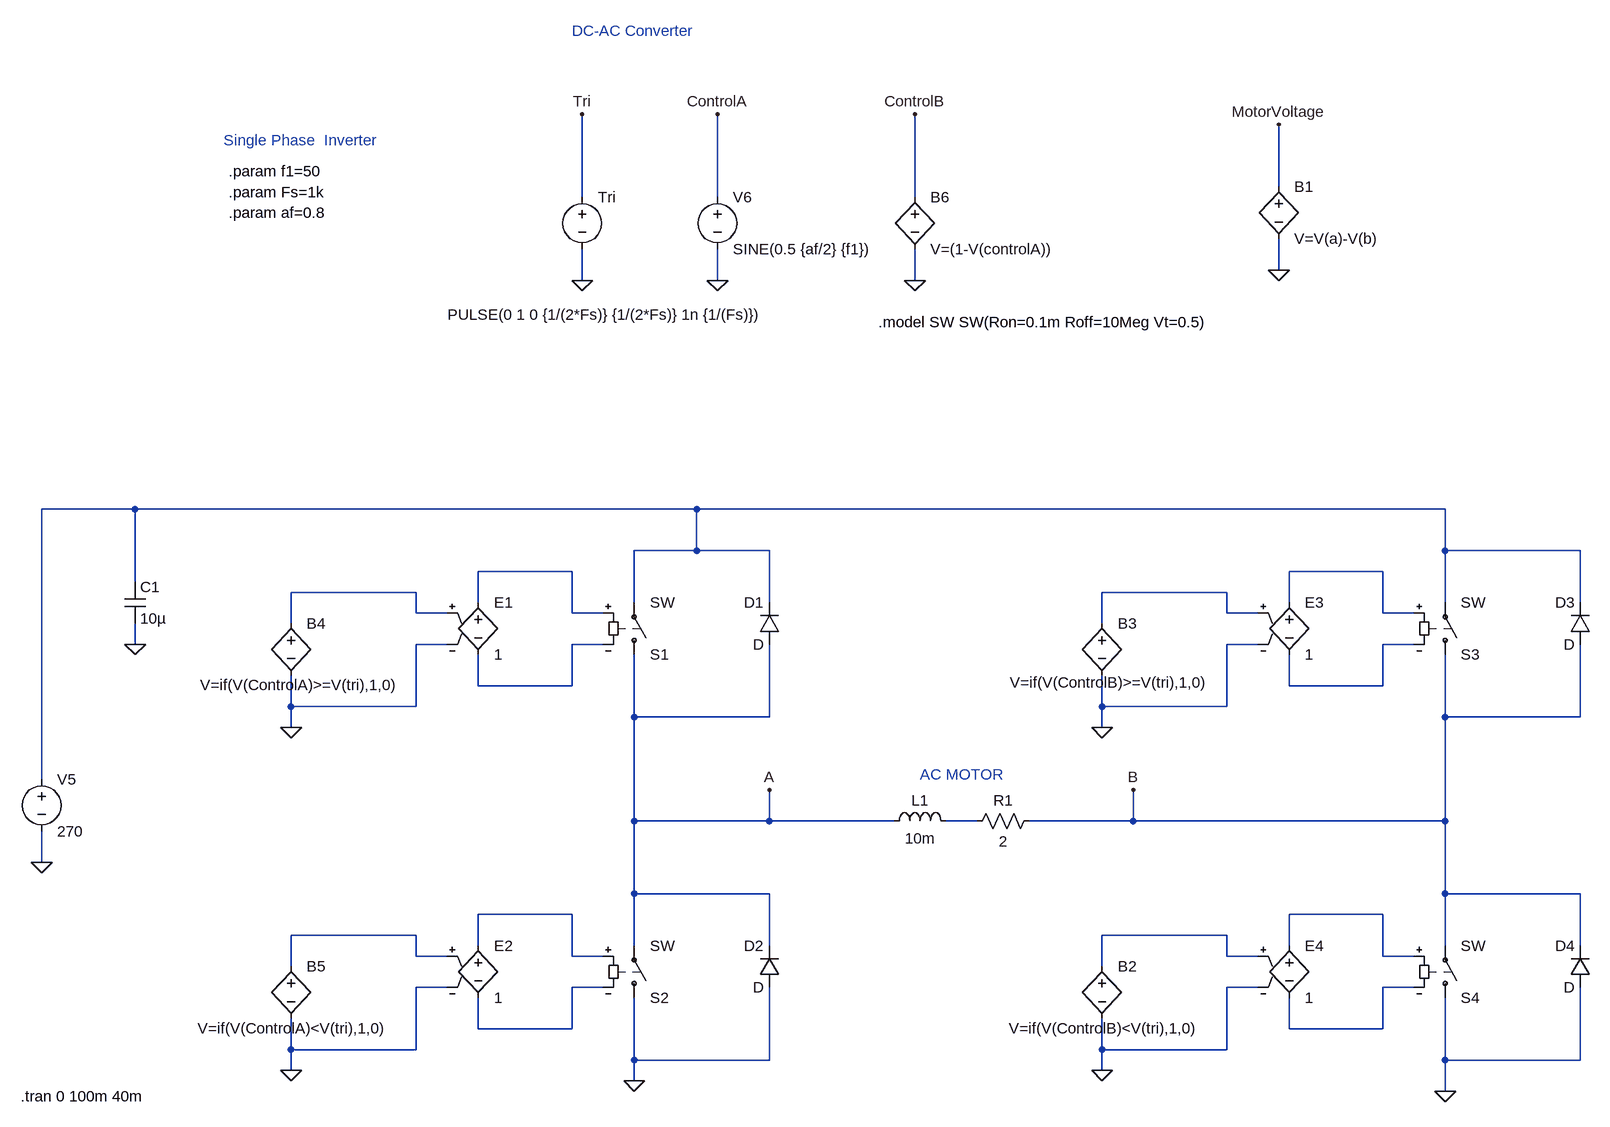
[diagram p0: schematic schematic.asc]
schematic.asc, the LTspice schematic file:
Version 4
SHEET 1 1928 772
WIRE 1360 -688 1360 -784
WIRE 288 -672 288 -800
WIRE 496 -672 496 -800
WIRE 800 -672 800 -800
WIRE 1360 -560 1360 -608
WIRE 288 -544 288 -592
WIRE 496 -544 496 -592
WIRE 800 -544 800 -592
WIRE -400 -192 -544 -192
WIRE 464 -192 -400 -192
WIRE 1616 -192 464 -192
WIRE 464 -128 464 -192
WIRE 464 -128 368 -128
WIRE 576 -128 464 -128
WIRE 1616 -128 1616 -192
WIRE 1824 -128 1616 -128
WIRE 272 -96 128 -96
WIRE 1520 -96 1376 -96
WIRE -400 -80 -400 -192
WIRE 32 -64 -160 -64
WIRE 1280 -64 1088 -64
WIRE 128 -48 128 -96
WIRE 368 -48 368 -128
WIRE 576 -48 576 -128
WIRE 1376 -48 1376 -96
WIRE 1616 -48 1616 -128
WIRE 1824 -48 1824 -128
WIRE 32 -32 32 -64
WIRE 80 -32 32 -32
WIRE 272 -32 272 -96
WIRE 320 -32 272 -32
WIRE 1280 -32 1280 -64
WIRE 1328 -32 1280 -32
WIRE 1520 -32 1520 -96
WIRE 1568 -32 1520 -32
WIRE -160 -16 -160 -64
WIRE 1088 -16 1088 -64
WIRE -400 16 -400 -16
WIRE 80 16 32 16
WIRE 320 16 272 16
WIRE 1328 16 1280 16
WIRE 1568 16 1520 16
WIRE 128 80 128 32
WIRE 272 80 272 16
WIRE 272 80 128 80
WIRE 1376 80 1376 32
WIRE 1520 80 1520 16
WIRE 1520 80 1376 80
WIRE -160 112 -160 64
WIRE 32 112 32 16
WIRE 32 112 -160 112
WIRE 1088 112 1088 64
WIRE 1280 112 1280 16
WIRE 1280 112 1088 112
WIRE 368 128 368 32
WIRE 576 128 576 16
WIRE 576 128 368 128
WIRE 1616 128 1616 32
WIRE 1824 128 1824 16
WIRE 1824 128 1616 128
WIRE -160 144 -160 112
WIRE 1088 144 1088 112
WIRE -544 224 -544 -192
WIRE 368 288 368 128
WIRE 576 288 576 240
WIRE 576 288 368 288
WIRE 768 288 576 288
WIRE 896 288 848 288
WIRE 1136 288 1136 240
WIRE 1136 288 976 288
WIRE 1616 288 1616 128
WIRE 1616 288 1136 288
WIRE -544 352 -544 304
WIRE 368 400 368 288
WIRE 576 400 368 400
WIRE 1616 400 1616 288
WIRE 1824 400 1616 400
WIRE 272 432 128 432
WIRE 1520 432 1376 432
WIRE 32 464 -160 464
WIRE 1280 464 1088 464
WIRE 128 480 128 432
WIRE 368 480 368 400
WIRE 576 480 576 400
WIRE 1376 480 1376 432
WIRE 1616 480 1616 400
WIRE 1824 480 1824 400
WIRE 32 496 32 464
WIRE 80 496 32 496
WIRE 272 496 272 432
WIRE 320 496 272 496
WIRE 1280 496 1280 464
WIRE 1328 496 1280 496
WIRE 1520 496 1520 432
WIRE 1568 496 1520 496
WIRE -160 512 -160 464
WIRE 1088 512 1088 464
WIRE 80 544 32 544
WIRE 320 544 272 544
WIRE 1328 544 1280 544
WIRE 1568 544 1520 544
WIRE 128 608 128 560
WIRE 272 608 272 544
WIRE 272 608 128 608
WIRE 1376 608 1376 560
WIRE 1520 608 1520 544
WIRE 1520 608 1376 608
WIRE -160 640 -160 592
WIRE 32 640 32 544
WIRE 32 640 -160 640
WIRE 1088 640 1088 592
WIRE 1280 640 1280 544
WIRE 1280 640 1088 640
WIRE 368 656 368 560
WIRE 576 656 576 544
WIRE 576 656 368 656
WIRE 1616 656 1616 560
WIRE 1824 656 1824 544
WIRE 1824 656 1616 656
WIRE -160 672 -160 640
WIRE 1088 672 1088 640
WIRE 368 688 368 656
WIRE 1616 704 1616 656
FLAG -160 144 0
FLAG -160 672 0
FLAG 1088 144 0
FLAG 1088 672 0
FLAG 288 -544 0
FLAG 496 -544 0
FLAG 800 -544 0
FLAG 800 -800 ControlB
FLAG 496 -800 ControlA
FLAG 288 -800 Tri
FLAG 368 688 0
FLAG -544 352 0
FLAG -400 16 0
FLAG 576 240 A
FLAG 1136 240 B
FLAG 1360 -560 0
FLAG 1360 -784 MotorVoltage
FLAG 1616 704 0
SYMBOL sw 368 48 M180
SYMATTR InstName S1
SYMBOL e 128 -64 R0
SYMATTR InstName E1
SYMATTR Value 1
SYMBOL diode 592 16 R180
WINDOW 0 24 64 Left 2
WINDOW 3 24 0 Left 2
SYMATTR InstName D1
SYMBOL sw 368 576 M180
SYMATTR InstName S2
SYMBOL e 128 464 R0
SYMATTR InstName E2
SYMATTR Value 1
SYMBOL diode 592 544 R180
WINDOW 0 24 64 Left 2
WINDOW 3 24 0 Left 2
SYMATTR InstName D2
SYMBOL sw 1616 48 M180
SYMATTR InstName S3
SYMBOL e 1376 -64 R0
SYMATTR InstName E3
SYMATTR Value 1
SYMBOL diode 1840 16 R180
WINDOW 0 24 64 Left 2
WINDOW 3 24 0 Left 2
SYMATTR InstName D3
SYMBOL sw 1616 576 M180
SYMATTR InstName S4
SYMBOL e 1376 464 R0
SYMATTR InstName E4
SYMATTR Value 1
SYMBOL diode 1840 544 R180
WINDOW 0 24 64 Left 2
WINDOW 3 24 0 Left 2
SYMATTR InstName D4
SYMBOL voltage 288 -688 R0
WINDOW 3 -207 197 Left 2
WINDOW 123 0 0 Left 0
WINDOW 39 0 0 Left 0
SYMATTR Value PULSE(0 1 0 {1/(2*Fs)} {1/(2*Fs)} 1n {1/(Fs)})
SYMATTR InstName Tri
SYMBOL voltage 496 -688 R0
WINDOW 123 0 0 Left 0
WINDOW 39 0 0 Left 0
SYMATTR InstName V6
SYMATTR Value SINE(0.5 {af/2} {f1})
SYMBOL voltage -544 208 R0
WINDOW 123 0 0 Left 0
WINDOW 39 0 0 Left 0
SYMATTR InstName V5
SYMATTR Value 270
SYMBOL cap -416 -80 R0
SYMATTR InstName C1
SYMATTR Value 10µ
SYMBOL ind 752 304 R270
WINDOW 0 32 56 VTop 2
WINDOW 3 5 56 VBottom 2
SYMATTR InstName L1
SYMATTR Value 10m
SYMBOL res 992 272 R90
WINDOW 0 0 56 VBottom 2
WINDOW 3 32 56 VTop 2
SYMATTR InstName R1
SYMATTR Value 2
SYMBOL bv 1088 496 R0
WINDOW 3 -143 111 Left 2
SYMATTR Value V=if(V(ControlB)<V(tri),1,0)
SYMATTR InstName B2
SYMBOL bv 1088 -32 R0
WINDOW 3 -142 107 Left 2
SYMATTR Value V=if(V(ControlB)>=V(tri),1,0)
SYMATTR InstName B3
SYMBOL bv -160 -32 R0
WINDOW 3 -140 111 Left 2
SYMATTR Value V=if(V(ControlA)>=V(tri),1,0)
SYMATTR InstName B4
SYMBOL bv -160 496 R0
WINDOW 3 -144 111 Left 2
SYMATTR Value V=if(V(ControlA)<V(tri),1,0)
SYMATTR InstName B5
SYMBOL bv 800 -688 R0
SYMATTR InstName B6
SYMATTR Value V=(1-V(controlA))
SYMBOL bv 1360 -704 R0
SYMATTR InstName B1
SYMATTR Value V=V(a)-V(b)
TEXT -264 -760 Left 2 ;Single Phase  Inverter
TEXT -256 -712 Left 2 !.param f1=50
TEXT -256 -680 Left 2 !.param Fs=1k
TEXT -256 -648 Left 2 !.param af=0.8
TEXT 744 -480 Left 2 !.model SW SW(Ron=0.1m Roff=10Meg Vt=0.5)
TEXT -576 712 Left 2 !.tran 0 100m 40m
TEXT 272 -928 Left 2 ;DC-AC Converter
TEXT 808 216 Left 2 ;AC MOTOR

The netlist it stands for:
* schematic.asc
S1 A N001 N002 N006 SW
E1 N002 N006 N004 0 1
D1 A N001 D
S2 0 A N009 N013 SW
E2 N009 N013 N011 0 1
D2 0 A D
S3 B N001 N003 N007 SW
E3 N003 N007 N005 0 1
D3 B N001 D
S4 0 B N010 N014 SW
E4 N010 N014 N012 0 1
D4 0 B D
V§Tri Tri 0 PULSE(0 1 0 {1/(2*Fs)} {1/(2*Fs)} 1n {1/(Fs)})
V6 ControlA 0 SINE(0.5 {af/2} {f1})
V5 N001 0 270
C1 N001 0 10µ
L1 A N008 10m
R1 B N008 2
B2 N012 0 V=if(V(ControlB)<V(tri),1,0)
B3 N005 0 V=if(V(ControlB)>=V(tri),1,0)
B4 N004 0 V=if(V(ControlA)>=V(tri),1,0)
B5 N011 0 V=if(V(ControlA)<V(tri),1,0)
B6 ControlB 0 V=(1-V(controlA))
B1 MotorVoltage 0 V=V(a)-V(b)
.model D D
.lib standard.dio
* Single Phase  Inverter
.param f1=50
.param Fs=1k
.param af=0.8
.model SW SW(Ron=0.1m Roff=10Meg Vt=0.5)
.tran 0 100m 40m
* DC-AC Converter
* AC MOTOR
.backanno
.end